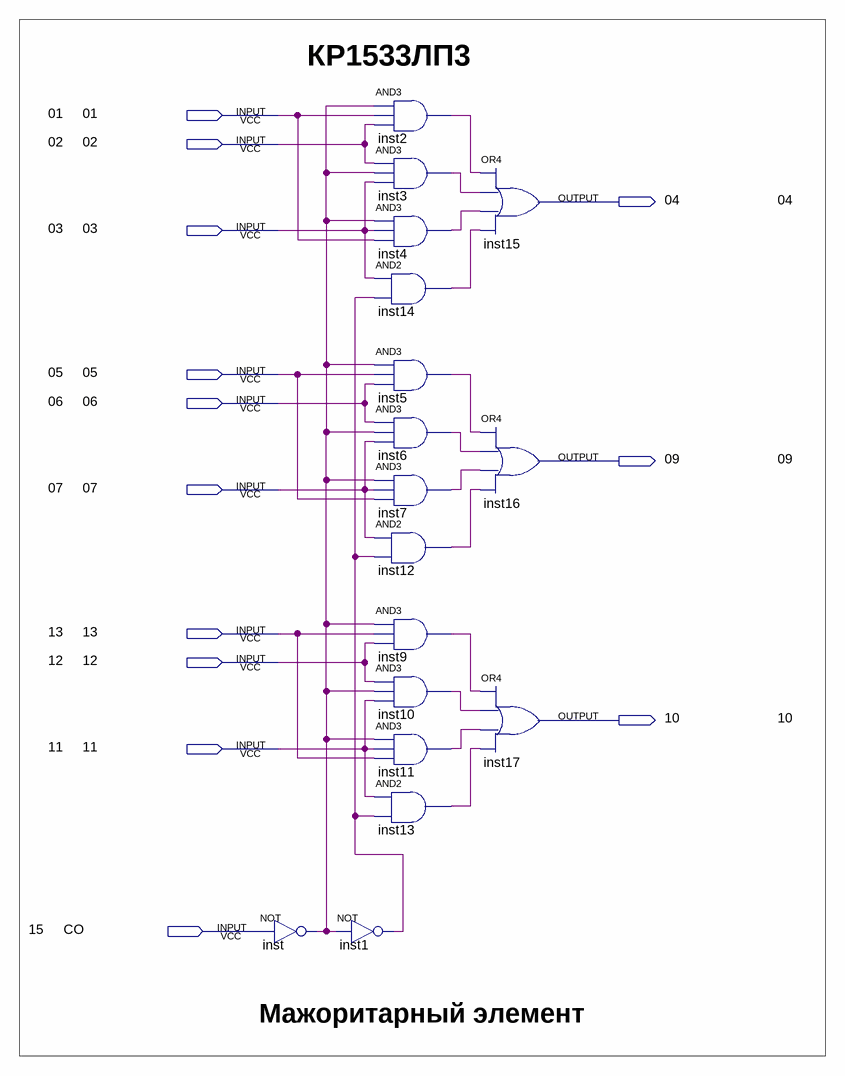
[diagram p0: schematic sheet]
// Quartus schematic KP1533LP3.bdf as structural Verilog: 17 symbols, 13 pins
module KP1533LP3 (
  input  \01 ,
  input  \02 ,
  input  \03 ,
  input  \05 ,
  input  \06 ,
  input  \07 ,
  input  \13 ,
  input  \12 ,
  input  \11 ,
  input  CO,
  output \04 ,
  output \09 ,
  output \10 
);

  wire inst1_out, inst2_out, inst3_out, inst4_out, inst5_out, inst6_out, inst7_out, inst9_out, inst10_out,
       inst11_out, inst12_out, inst13_out, inst14_out, inst_out;

  not inst (inst_out, CO);
  not inst1 (inst1_out, inst_out);
  and inst2 (inst2_out, inst_out, \01 , \02 );
  and inst3 (inst3_out, \02 , inst_out, \03 );
  and inst4 (inst4_out, inst_out, \03 , \01 );
  and inst14 (inst14_out, \03 , inst1_out);
  and inst5 (inst5_out, inst_out, \05 , \06 );
  and inst6 (inst6_out, \06 , inst_out, \07 );
  and inst7 (inst7_out, inst_out, \07 , \05 );
  and inst12 (inst12_out, \07 , inst1_out);
  and inst9 (inst9_out, inst_out, \13 , \12 );
  and inst10 (inst10_out, \12 , inst_out, \11 );
  and inst11 (inst11_out, inst_out, \11 , \13 );
  and inst13 (inst13_out, \11 , inst1_out);
  or inst15 (\04 , inst2_out, inst3_out, inst4_out, inst14_out);
  or inst16 (\09 , inst5_out, inst6_out, inst7_out, inst12_out);
  or inst17 (\10 , inst9_out, inst10_out, inst11_out, inst13_out);

  // Notes on the sheet:
  //   КР1533ЛП3
  //   01
  //   02
  //   04
  //   03
  //   05
  //   06
  //   09
  //   07
  //   13
  //   12
  //   10
  //   11
  //   15
  //   Мажоритарный элемент
endmodule
